# Altium project MCU SAMD ATSAMD21G18A-MU.PrjPCB
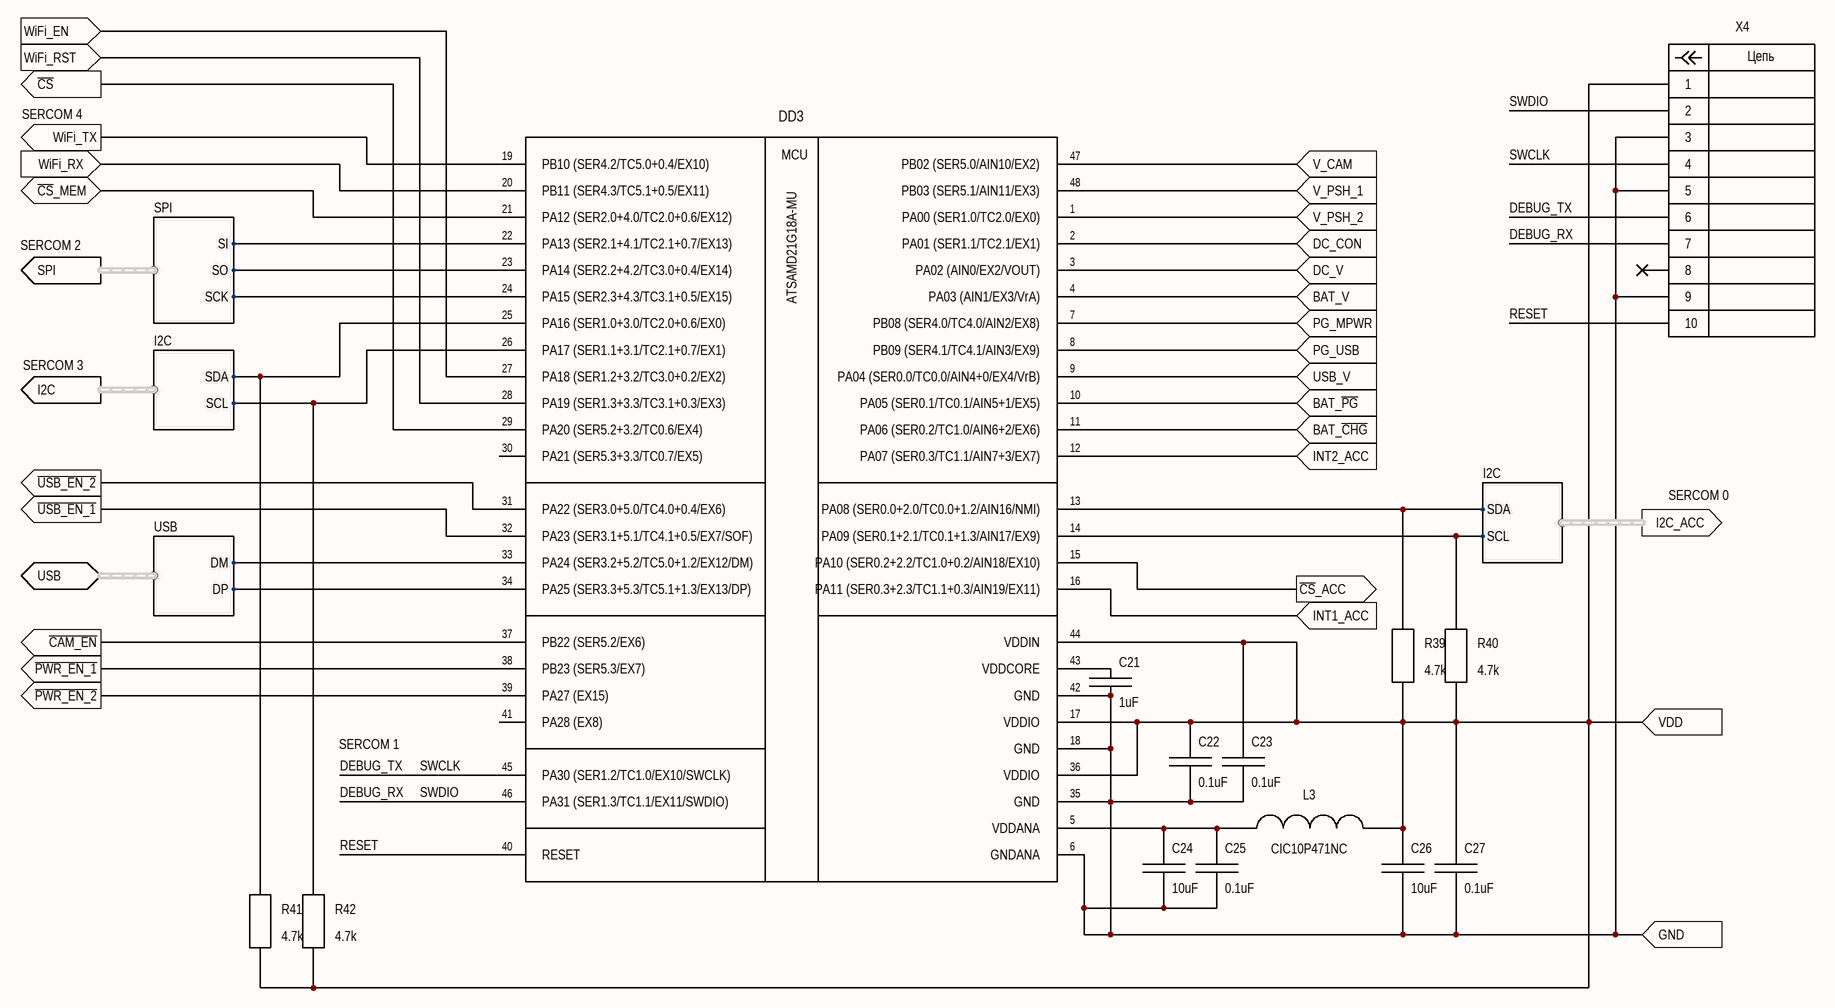
[diagram p0: MCU SAMD ATSAMD21G18A-MU.SchDoc]
1 sheet, 14 parts. Net scope: flat (ports and power ports of the same name join across sheets).

## Sheet MCU SAMD ATSAMD21G18A-MU.SchDoc
size 420 x 297 mm; Author: Мурашкин Д.В.; Address1: Address1; Address2: Address2; Address3: Address3; Address4: Address4; DocumentNumber: SS19946-01; Scale: 1:1; Letter1Column: Э; PartName: Основной контроллер

### Parts
C21  1uF  [CAPC1608L]
C22  0.1uF  [CAPC1608L]
C23  0.1uF  [CAPC1608L]
C24  10uF  [CAPC2012L]
C25  0.1uF  [CAPC1608L]
C26  10uF  [CAPC2012L]
C27  0.1uF  [CAPC1608L]
DD3  ATSAMD21G18A-MU  [QFN-48]
L3  CIC10P471NC  [FB1608L]
R39  4.7k  [RESC1608L]
R40  4.7k  [RESC1608L]
R41  4.7k  [RESC1608L]
R42  4.7k  [RESC1608L]
X4  SWD ICE connector  [SWD ICE Connector]  (value not drawn)  (no BOM)

### Ports
BAT_V (in), BAT_~{CHG} (in), BAT_~{PG} (in), DC_CON (in), DC_V (in), GND, I2C (harness I2C), I2C_ACC (harness I2C), INT1_ACC (in), INT2_ACC (in), PG_MPWR (in), PG_USB (in), SPI (harness SPI), USB (harness USB), USB_V (in), V_CAM (in), V_PSH_1 (in), V_PSH_2 (in), VDD, WiFi_EN (in), WiFi_RST (in), WiFi_RX (in), WiFi_TX (out), ~{CAM_EN} (out), ~{CS} (out), ~{CS}_ACC (out), ~{CS}_MEM (bidir), ~{PWR_EN_1} (out), ~{PWR_EN_2} (out), ~{USB_EN_1} (out), ~{USB_EN_2} (out)

### Harnesses
I2C: SDA, SCL
SPI: SI, SO, SCK
USB: DM, DP

### Nets
DEBUG_RX: DD3.46(PA31_(SER1.3/TC1.1/EX11/SWDIO)) X4.2 X4.7  [also labelled SWDIO]
DEBUG_TX: DD3.45(PA30_(SER1.2/TC1.0/EX10/SWCLK)) X4.4 X4.6  [also labelled SWCLK]
RESET: DD3.40(RESET) X4.10
NetC21_1: C21.1 DD3.43(VDDCORE)
NetC21_2: C21.2 C22.2 C23.2 C24.2 C25.2 C26.2 C27.2 DD3.6(GNDANA) DD3.18(GND) DD3.35(GND) DD3.42(GND) X4.3 X4.5 X4.9 ; port GND
NetC22_1: C22.1 C23.1 C26.1 C27.1 DD3.17(VDDIO) DD3.36(VDDIO) DD3.44(VDDIN) L3.2 R39.2 R40.2 R41.2 R42.2 X4.1 ; port VDD
NetC24_1: C24.1 C25.1 DD3.5(VDDANA) L3.1
NetDD3_1: DD3.1(PA00_(SER1.0/TC2.0/EX0)) ; port V_PSH_2
NetDD3_2: DD3.2(PA01_(SER1.1/TC2.1/EX1)) ; port DC_CON
NetDD3_3: DD3.3(PA02_(AIN0/EX2/VOUT)) ; port DC_V
NetDD3_4: DD3.4(PA03_(AIN1/EX3/VrA)) ; port BAT_V
NetDD3_7: DD3.7(PB08_(SER4.0/TC4.0/AIN2/EX8)) ; port PG_MPWR
NetDD3_8: DD3.8(PB09_(SER4.1/TC4.1/AIN3/EX9)) ; port PG_USB
NetDD3_9: DD3.9(PA04_(SER0.0/TC0.0/AIN4+0/EX4/VrB)) ; port USB_V
NetDD3_10: DD3.10(PA05_(SER0.1/TC0.1/AIN5+1/EX5)) ; port BAT_~{PG}
NetDD3_11: DD3.11(PA06_(SER0.2/TC1.0/AIN6+2/EX6)) ; port BAT_~{CHG}
NetDD3_12: DD3.12(PA07_(SER0.3/TC1.1/AIN7+3/EX7)) ; port INT2_ACC
NetDD3_13: DD3.13(PA08_(SER0.0+2.0/TC0.0+1.2/AIN16/NMI)) R39.1 ; port I2C_ACC.SDA
NetDD3_14: DD3.14(PA09_(SER0.1+2.1/TC0.1+1.3/AIN17/EX9)) R40.1 ; port I2C_ACC.SCL
NetDD3_15: DD3.15(PA10_(SER0.2+2.2/TC1.0+0.2/AIN18/EX10)) ; port ~{CS}_ACC
NetDD3_16: DD3.16(PA11_(SER0.3+2.3/TC1.1+0.3/AIN19/EX11)) ; port INT1_ACC
NetDD3_19: DD3.19(PB10_(SER4.2/TC5.0+0.4/EX10)) ; port WiFi_TX
NetDD3_20: DD3.20(PB11_(SER4.3/TC5.1+0.5/EX11)) ; port WiFi_RX
NetDD3_21: DD3.21(PA12_(SER2.0+4.0/TC2.0+0.6/EX12)) ; port ~{CS}_MEM
NetDD3_22: DD3.22(PA13_(SER2.1+4.1/TC2.1+0.7/EX13)) ; port SPI.SI
NetDD3_23: DD3.23(PA14_(SER2.2+4.2/TC3.0+0.4/EX14)) ; port SPI.SO
NetDD3_24: DD3.24(PA15_(SER2.3+4.3/TC3.1+0.5/EX15)) ; port SPI.SCK
NetDD3_25: DD3.25(PA16_(SER1.0+3.0/TC2.0+0.6/EX0)) R41.1 ; port I2C.SDA
NetDD3_26: DD3.26(PA17_(SER1.1+3.1/TC2.1+0.7/EX1)) R42.1 ; port I2C.SCL
NetDD3_27: DD3.27(PA18_(SER1.2+3.2/TC3.0+0.2/EX2)) ; port WiFi_EN
NetDD3_28: DD3.28(PA19_(SER1.3+3.3/TC3.1+0.3/EX3)) ; port WiFi_RST
NetDD3_29: DD3.29(PA20_(SER5.2+3.2/TC0.6/EX4)) ; port ~{CS}
NetDD3_31: DD3.31(PA22_(SER3.0+5.0/TC4.0+0.4/EX6)) ; port ~{USB_EN_2}
NetDD3_32: DD3.32(PA23_(SER3.1+5.1/TC4.1+0.5/EX7/SOF)) ; port ~{USB_EN_1}
NetDD3_33: DD3.33(PA24_(SER3.2+5.2/TC5.0+1.2/EX12/DM)) ; port USB.DM
NetDD3_34: DD3.34(PA25_(SER3.3+5.3/TC5.1+1.3/EX13/DP)) ; port USB.DP
NetDD3_37: DD3.37(PB22_(SER5.2/EX6)) ; port ~{CAM_EN}
NetDD3_38: DD3.38(PB23_(SER5.3/EX7)) ; port ~{PWR_EN_1}
NetDD3_39: DD3.39(PA27_(EX15)) ; port ~{PWR_EN_2}
NetDD3_47: DD3.47(PB02_(SER5.0/AIN10/EX2)) ; port V_CAM
NetDD3_48: DD3.48(PB03_(SER5.1/AIN11/EX3)) ; port V_PSH_1

Not connected (* = marked no-connect by the designer): DD3 30(PA21_(SER5.3+3.3/TC0.7/EX5)) 41(PA28_(EX8)); X4 8*

### Notes on the sheet
- SERCOM 4
- SERCOM 2
- SERCOM 3
- SERCOM 0
- SERCOM 1
- Перв. примен.
- Справ. №
- Подп. и дата
- Инв. № дубл.
- Взам. инв. №
- Разраб.
- Изм.
- Лист
- № докум.
- Подп.
- Дата
- Лит.
- Масса
- Масштаб
- Пров.
- Т.контр.
- Листов
- Инв. № подл.
- Утв.
- Н.контр.
- 2.106-A3
- Копировал
- Формат А3
- (in symbol ATSAMD21G18A-MU) MCU
- (in symbol SWD ICE connector) Цепь

### Library data of the parts
C21 = CC0603KRX5R8BB105: Capacitor Ceramic 1uF 25V; Manufacturer: Yageo; Group: Ceramic Capacitors; Temperature Coefficient: X5R; Tolerance: ±10%; Short description: CAP CER 1UF 25V X5R 0603; Type: Ceramic; Part name: CC0603KRX5R8BB105; Voltage: 25V; Package: 1608; Value: 1uF
C22 C23 C25 C27 = CC0603KRX7R8BB104: Capacitor Ceramic 0.1uF 25V; Manufacturer: Yageo; Group: Ceramic Capacitors; Temperature Coefficient: X7R; Tolerance: ±10%; Short description: CAP CER 0.1UF 25V X7R 0603; Type: Ceramic; Part name: CC0603KRX7R8BB104; Voltage: 25 V; Package: 1608; Value: 0.1uF
C24 C26 = CC0805KKX5R8BB106: Capacitor Ceramic 10uF 25V; Manufacturer: Yageo; Group: Ceramic Capacitors; Temperature Coefficient: X5R; Tolerance: ±10%; Short description: CAP CER 10UF 25V X5R 0805; Type: Ceramic; Part name: CC0805KKX5R8BB106; Voltage: 25V; Package: 2012; Value: 10uF
DD3 = ATSAMD21G18A-MU: MCU SAMD21 Cortex-M0+; Manufacturer: Atmel; Group: Embeded microcontroller; Short description: IC MCU 32BIT 256KB FLASH 48QFN; Package: VFQFN-48; Part name: ATSAMD21G18A-MU
L3 = CIC10P471NC: Ferrite Bead 1.2A 470Ohm; Manufacturer: Samsung Electro-Mechanics America; Group: Ferrite Beads and Chips; Current Rating: 1.7A; Short description: 470 Ohm Impedance Ferrite Bead 0603 (1608 Metric) Surface Mount Power Line 1.2A 1 Lines 150 mOhm Max DCR -55°C ~ 125°C; Part name: CIC10P471NC; Package: 1608
R39-R42 = RC0603JR-074K7L: Resistor Ceramic 4.7k 1608; Manufacturer: Yageo; Group: Resistors; Temperature Coefficient: ±100ppm/°C; Tolerance: ±5%; Power: 0.1W; Short description: RES SMD 4.7K OHM 5% 1/10W 0603; Part name: RC0603JR-074K7L; Type: Thin Film; Package: 1608; Value: 4.7k
X4 = SWD ICE connector: Debug SWD ICE Pads; Manufacturer: Atmel; Group: Connectors; Package: 10 DIP 1.27; Distributor: Atmel